# EAGLE design M703E (EAGLE 6.6.0)
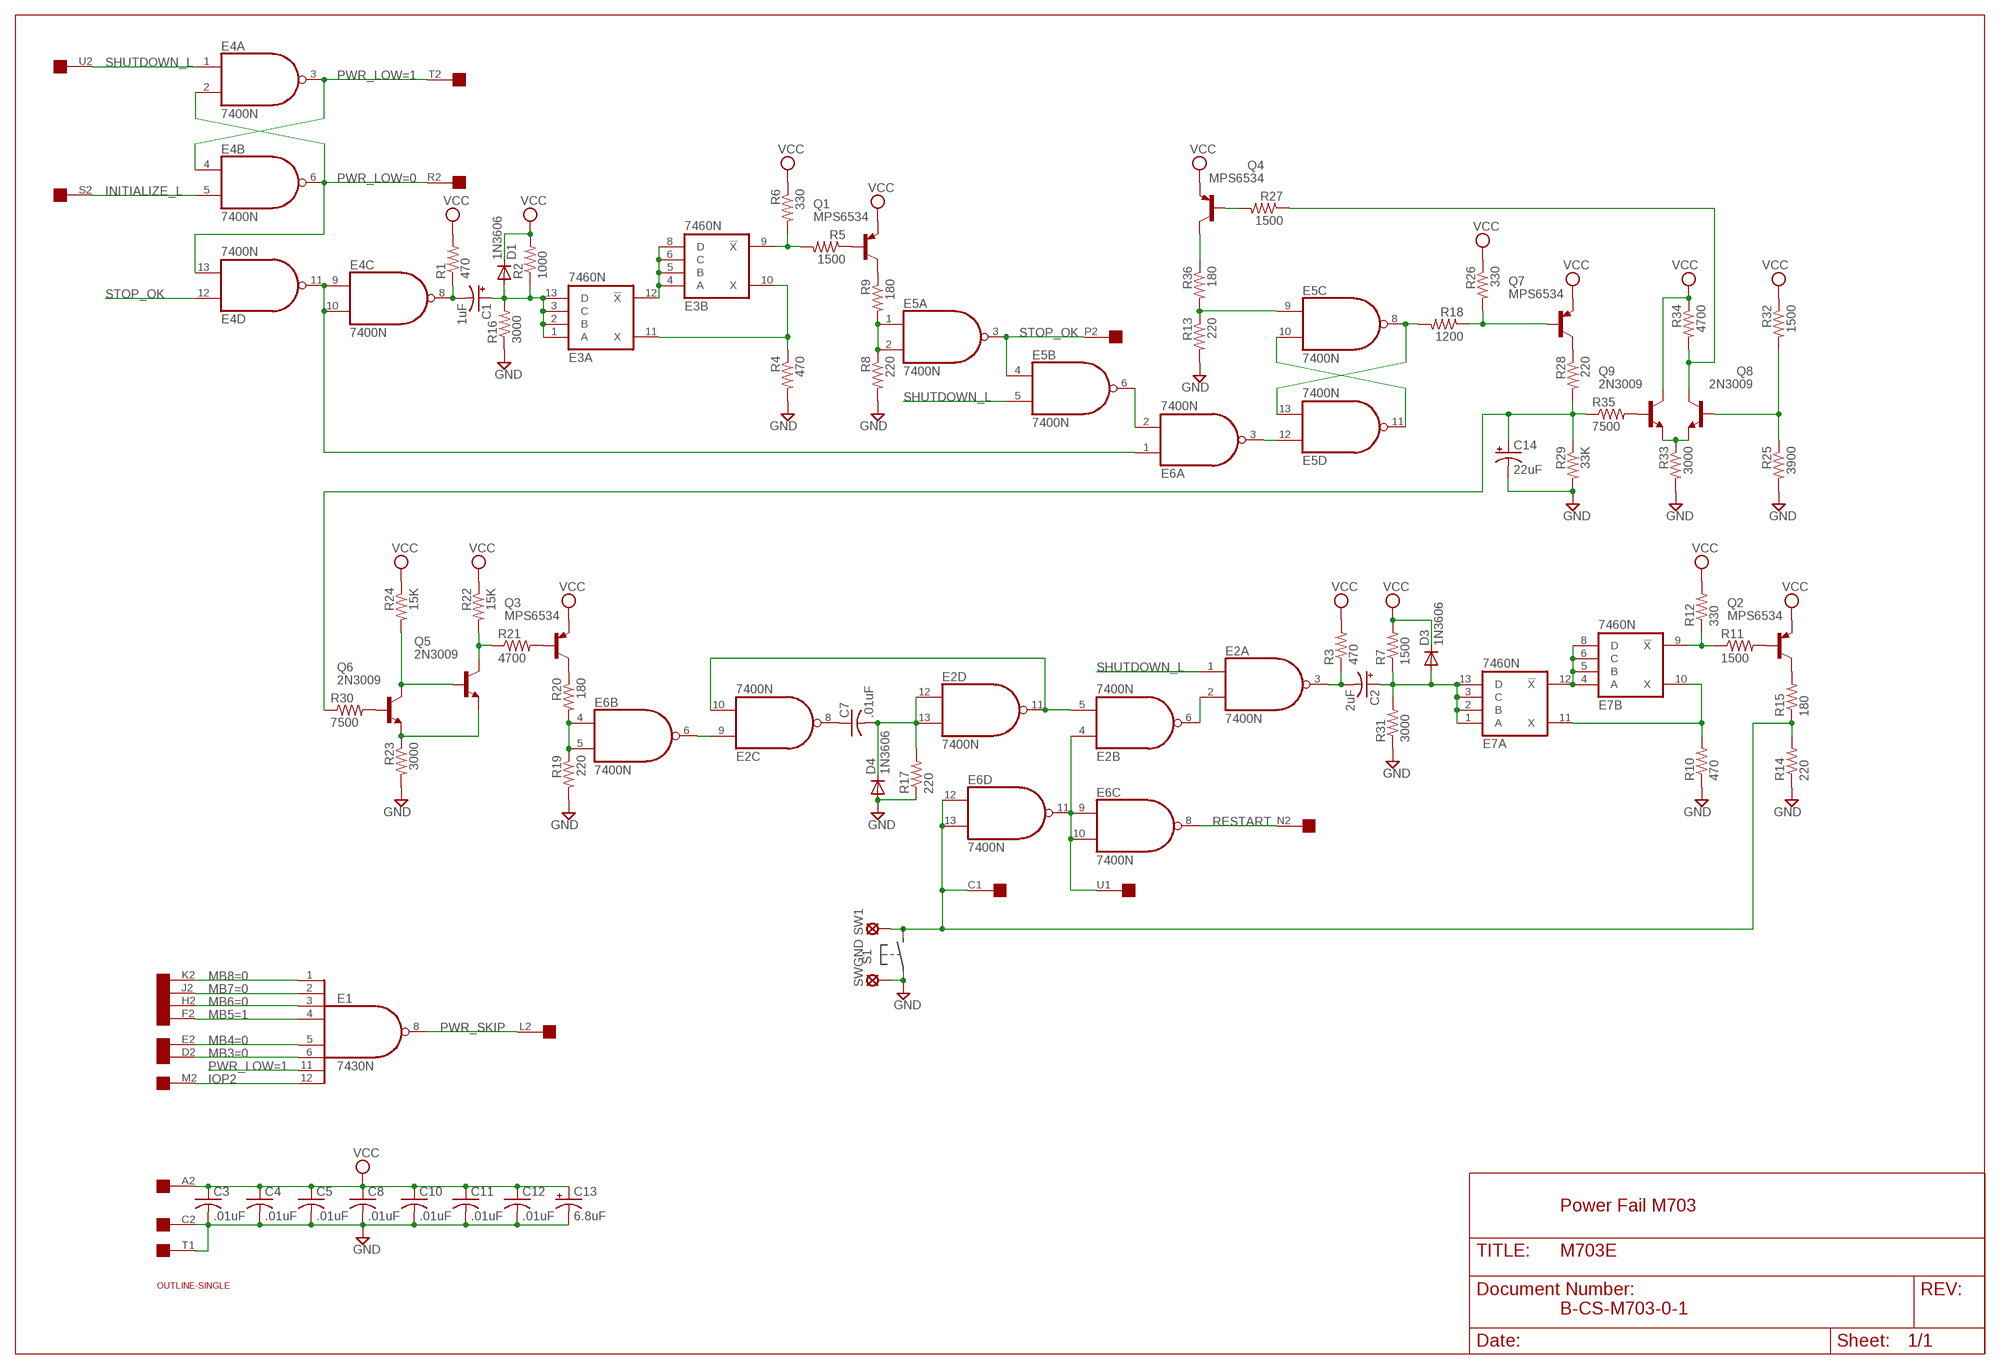
[diagram p0: schematic, sheet 1]

## Parts
C1  1uF  CPOL-USE12-4AXIAL  [E12-4]
C2  2uF  CPOL-USE12-4AXIAL  [E12-4]
C3  .01uF  C-US050-025X075  [C050-025X075]
C4  .01uF  C-US050-025X075  [C050-025X075]
C5  .01uF  C-US050-025X075  [C050-025X075]
C7  .01uF  C-US050-025X075  [C050-025X075]
C8  .01uF  C-US050-025X075  [C050-025X075]
C10  .01uF  C-US050-025X075  [C050-025X075]
C11  .01uF  C-US050-025X075  [C050-025X075]
C12  .01uF  C-US050-025X075  [C050-025X075]
C13  6.8uF  CPOL-USE15-5AXIAL  [E15-5]
C14  22uF  CPOL-USE15-5AXIAL  [E15-5]
D1  1N3606  1N4148DO35-10  [DO35-10]
D3  1N3606  1N4148DO35-10  [DO35-10]
D4  1N3606  1N4148DO35-10  [DO35-10]
E1  7430N  [DIL14]
E2  7400N  [DIL14]
E3  7460N  [DIL14]
E4  7400N  [DIL14]
E5  7400N  [DIL14]
E6  7400N  [DIL14]
E7  7460N  [DIL14]
Q1  MPS6534  2N2904  [TO39]
Q2  MPS6534  2N2904  [TO39]
Q3  MPS6534  2N2904  [TO39]
Q4  MPS6534  2N2904  [TO39]
Q5  2N3009  2N2219  [TO5]
Q6  2N3009  2N2219  [TO5]
Q7  MPS6534  2N2904  [TO39]
Q8  2N3009  2N2219  [TO5]
Q9  2N3009  2N2219  [TO5]
R1  470  R-US_0207/10  [0207/10]
R2  1000  R-US_0207/10  [0207/10]
R3  470  R-US_0207/10  [0207/10]
R4  470  R-US_0207/10  [0207/10]
R5  1500  R-US_0207/10  [0207/10]
R6  330  R-US_0207/10  [0207/10]
R7  1500  R-US_0207/10  [0207/10]
R8  220  R-US_0207/10  [0207/10]
R9  180  R-US_0207/10  [0207/10]
R10  470  R-US_0207/10  [0207/10]
R11  1500  R-US_0207/10  [0207/10]
R12  330  R-US_0207/10  [0207/10]
R13  220  R-US_0207/10  [0207/10]
R14  220  R-US_0207/10  [0207/10]
R15  180  R-US_0207/10  [0207/10]
R16  3000  R-US_0207/10  [0207/10]
R17  220  R-US_0207/10  [0207/10]
R18  1200  R-US_0207/10  [0207/10]
R19  220  R-US_0207/10  [0207/10]
R20  180  R-US_0207/10  [0207/10]
R21  4700  R-US_0207/10  [0207/10]
R22  15K  R-US_0207/10  [0207/10]
R23  3000  R-US_0207/10  [0207/10]
R24  15K  R-US_0207/10  [0207/10]
R25  3900  R-US_0207/10  [0207/10]
R26  330  R-US_0207/10  [0207/10]
R27  1500  R-US_0207/10  [0207/10]
R28  220  R-US_0207/10  [0207/10]
R29  33K  R-US_0207/10  [0207/10]
R30  7500  R-US_0207/10  [0207/10]
R31  3000  R-US_0207/10  [0207/10]
R32  1500  R-US_0207/10  [0207/10]
R33  3000  R-US_0207/10  [0207/10]
R34  4700  R-US_0207/10  [0207/10]
R35  7500  R-US_0207/10  [0207/10]
R36  180  R-US_0207/10  [0207/10]
SW1  SE14  [SE14]
SWGND  SE14  [SE14]
U$2  SINGLE  [EDGE-CON2]
U$4  OUTLINE-SINGLE  [SINGLE]

## Nets
GND [Supply]: C3.2 C4.2 C5.2 C8.2 C10.2 C11.2 C12.2 C13.- C14.- D4.A R4.2 R8.2 R10.1 R13.2 R14.1 R16.1 R17.1 R19.2 R23.2 R25.2 R29.2 R31.1 R33.2 SWGND.MP U$2.C2 U$2.T1
INITIALIZE_L: E4.5(B:I1) U$2.S2
IOP2: E1.12(I7) U$2.M2
MB3=0: E1.6(I5) U$2.D2
MB4=0: E1.5(I4) U$2.E2
MB5=1: E1.4(I3) U$2.F2
MB6=0: E1.3(I2) U$2.H2
MB7=0: E1.2(I1) U$2.J2
MB8=0: E1.1(I0) U$2.K2
N$1: E4.9(C:I0) E4.10(C:I1) E4.11(D:O) E6.1(A:I0)
N$2: E2.4(B:I0) E6.9(C:I0) E6.10(C:I1) E6.11(D:O) U$2.U1
N$3: C1.- E4.8(C:O) R1.1
N$4: E6.4(B:I0) E6.5(B:I1) R19.1 R20.2
N$5: E3.4(B:A) E3.5(B:B) E3.6(B:C) E3.8(B:D) E3.12(A:!X)
N$6: C1.+ D1.A E3.1(A:A) E3.2(A:B) E3.3(A:C) E3.13(A:D) R2.1 R16.2
N$7: C2.+ D3.A E7.1(A:A) E7.2(A:B) E7.3(A:C) E7.13(A:D) R7.1 R31.2
N$8: E7.4(B:A) E7.5(B:B) E7.6(B:C) E7.8(B:D) E7.12(A:!X)
N$9: E5.1(A:I0) E5.2(A:I1) R8.1 R9.2
N$10: C7.2 D4.C E2.12(D:I0) E2.13(D:I1) R17.2
N$11: E2.5(B:I1) E2.10(C:I1) E2.11(D:O)
N$12: C7.1 E2.8(C:O)
N$14: E2.2(A:I1) E2.6(B:O)
N$15: E5.8(C:O) E5.13(D:I1) R18.2
N$16: C2.- E2.3(A:O) R3.1
N$17: E6.12(D:I0) E6.13(D:I1) R14.2 R15.1 SW1.MP U$2.C1
N$18: E2.9(C:I0) E6.6(B:O)
N$19: E5.12(D:I0) E6.3(A:O)
N$20: E5.6(B:O) E6.2(A:I1)
N$21: Q1.2(B) R5.1
N$22: Q1.3(C) R9.1
N$23: E7.9(B:!X) R11.1 R12.1
N$24: E7.10(B:X) E7.11(A:X) R10.2
N$25: Q2.2(B) R11.2
N$26: E3.10(B:X) E3.11(A:X) R4.1
N$27: Q4.3(C) R36.1
N$28: E3.9(B:!X) R5.2 R6.2
N$29: E5.10(C:I1) E5.11(D:O)
N$30: E5.9(C:I0) R13.1 R36.2
N$31: Q7.2(B) R18.1 R26.2
N$32: Q8.1(E) Q9.1(E) R33.1
N$33: Q8.3(C) R27.1 R34.2
N$34: Q4.2(B) R27.2
N$35: Q8.2(B) R25.1 R32.2
N$36: Q9.2(B) R35.2
N$37: Q7.3(C) R28.1
N$38: C14.+ R28.2 R29.1 R30.1 R35.1
N$39: Q6.2(B) R30.2
N$40: Q5.2(B) Q6.3(C) R24.2
N$41: Q5.1(E) Q6.1(E) R23.1
N$42: Q5.3(C) R21.1 R22.2
N$43: Q3.2(B) R21.2
N$44: Q3.3(C) R20.1
N$46: Q2.3(C) R15.2
PWR_LOW=0: E4.2(A:I1) E4.6(B:O) E4.13(D:I1) U$2.R2
PWR_LOW=1: E1.11(I6) E4.3(A:O) E4.4(B:I0) U$2.T2
PWR_SKIP: E1.8(O) U$2.L2
RESTART: E6.8(C:O) U$2.N2
SHUTDOWN_L: E2.1(A:I0) E4.1(A:I0) E5.5(B:I1) U$2.U2
STOP_OK: E4.12(D:I0) E5.3(A:O) E5.4(B:I0) U$2.P2
VCC [Supply]: C3.1 C4.1 C5.1 C8.1 C10.1 C11.1 C12.1 C13.+ D1.C D3.C Q1.1(E) Q2.1(E) Q3.1(E) Q4.1(E) Q7.1(E) Q9.3(C) R1.2 R2.2 R3.2 R6.1 R7.2 R12.2 R22.1 R24.1 R26.1 R32.1 R34.1 U$2.A2
Unconnected: U$2.A1 U$2.B1 U$2.B2 U$2.D1 U$2.E1 U$2.F1 U$2.H1 U$2.J1 U$2.K1 U$2.L1 U$2.M1 U$2.N1 U$2.P1 U$2.R1 U$2.S1 U$2.V1 U$2.V2

## Notes on the sheet
- Power Fail M703
- B-CS-M703-0-1

## Power pins joined to a net without a drawn wire
GND: E1.7(GND) E2.7(P:GND) E3.7(P:GND) E4.7(P:GND) E5.7(P:GND) E6.7(P:GND) E7.7(P:GND)
VCC: E1.14(VCC) E2.14(P:VCC) E3.14(P:VCC) E4.14(P:VCC) E5.14(P:VCC) E6.14(P:VCC) E7.14(P:VCC)

## Library data of the parts
C1 C2 = dec-con:CPOL-USE12-4AXIAL: 0.5" veresion of an electrolytic
C3-C5 C7 C8 C10-C12 = rcl:C-US: CAPACITOR, American symbol
C13 C14 = rcl:CPOL-US: POLARIZED CAPACITOR, American symbol
D1 D3 D4 = diode:1N4148: DIODE high speed (Philips)
E1 = 74xx-us:74*30: 8-input NAND gate
E2 E4-E6 = 74xx-us:74*00: Quad 2-input NAND gate
E3 E7 = 74xx-us:74*60: Dual 4-input EXPANDER
Q1-Q4 Q7 = transistor-pnp:2N2904*: PNP Transistror
Q5 Q6 Q8 Q9 = transistor-npn:2N2219: NPN Transistor
R1-R36 = rcl:R-US_: RESISTOR, American symbol
SW1 SWGND = solpad:SE14: SOLDER PAD E1553, drill 1,4mm, distributor Buerklin, 07F820
U$2 = dec-con:SINGLE: Single-Height DEC board
U$4 = dec-con:OUTLINE-*: Board outlines for DEC boards.

## Net classes
1 Supply: width 0.813 mm

## Board
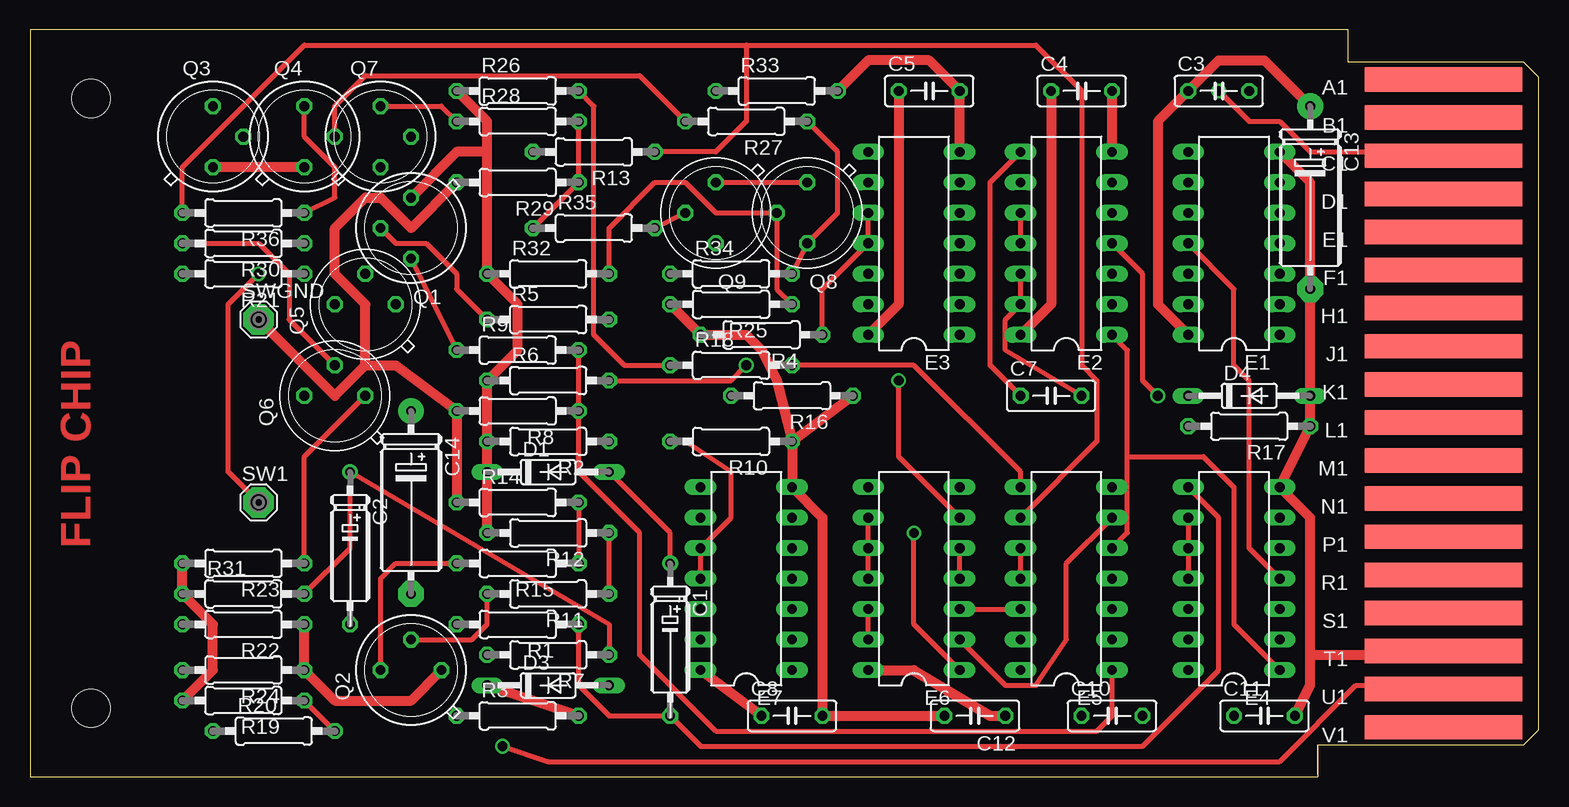
[diagram p1: board, top side]
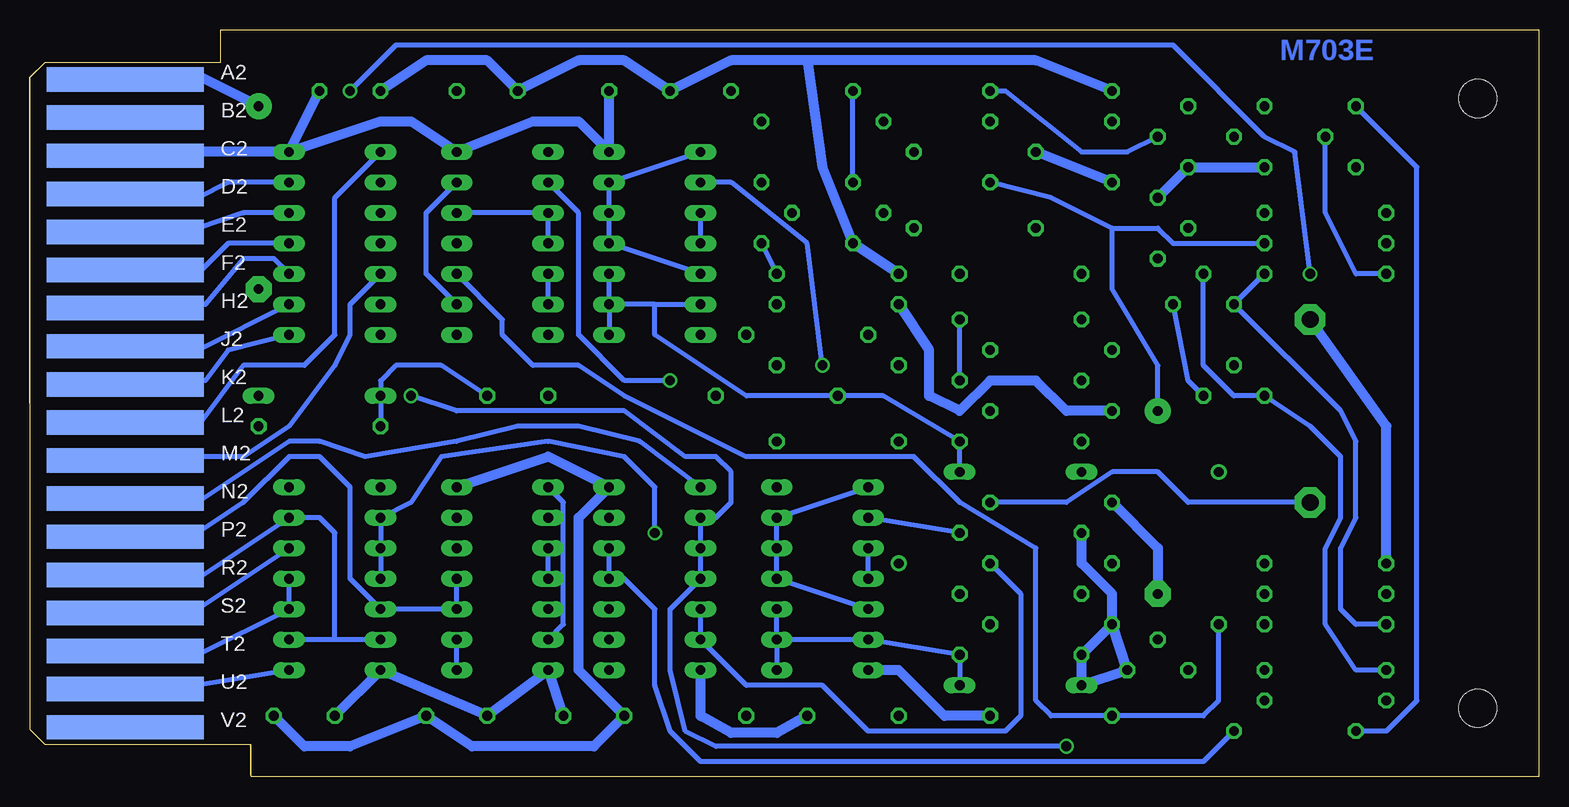
[diagram p2: board, bottom side, seen from below]

Size 125.73 x 62.23 mm. Coordinates in mm from the lower left corner, seen from the top.
Copper layers (1+16): Top 0.035mm / dielectric 1.5mm / Bottom 0.035mm
Design rules "16mils": minimum track width 16mil, minimum drill 32mil, track to track 15mil, track to pad 10mil, pad to pad 10mil, via to via 10mil, smd to smd 10mil, copper to edge 13mil, drill to drill 10mil, minimum pad ring 10mil, minimum via ring 8mil, stop-mask expansion 0mil, vias tented up to drill 0mil, thermal gap 10mil

### Footprints (pad centres in the part's own frame; a part is rotated, then mirrored left to right if it is on the bottom)
E12-4 = drill 0.813: + -7.62,0 | drill 0.813 octagon: - 5.08,0
C050-025X075 = drill 0.813 octagon: 1 -2.54,0; 2 2.54,0
E15-5 = drill 0.813 pad 2.159: + -7.62,0 | drill 0.813 pad 2.159 octagon: - 7.62,0
DO35-10 = drill 0.813 long: A 5.08,0; C -5.08,0
DIL14 = drill 0.813 long: 1 -7.62,-3.81; 2 -5.08,-3.81; 3 -2.54,-3.81; 4 0,-3.81; 5 2.54,-3.81; 6 5.08,-3.81; 7 7.62,-3.81; 8 7.62,3.81; 9 5.08,3.81; 10 2.54,3.81; 11 0,3.81; 12 -2.54,3.81; 13 -5.08,3.81; 14 -7.62,3.81
TO39 = drill 0.813 octagon: 1 0,-2.54; 2 2.54,0; 3 0,2.54
TO5 = drill 0.813 octagon: 1 0,-2.54; 2 2.54,0; 3 0,2.54
0207/10 = drill 0.813 octagon: 1 -5.08,0; 2 5.08,0
SE14 = drill 1.397 pad 2.54 octagon: MP 0,0
EDGE-CON2 = smd 13.106 x 2.032: A1 7.938,4.128; B1 7.938,7.303; C1 7.938,10.477; D1 7.938,13.652; E1 7.938,16.828; F1 7.938,20.003; H1 7.938,23.177; J1 7.938,26.352; K1 7.938,29.527; L1 7.938,32.703; M1 7.938,35.877; N1 7.938,39.053; P1 7.938,42.227; R1 7.938,45.403; S1 7.938,48.578; T1 7.938,51.752; U1 7.938,54.928; V1 7.938,58.102 | smd 13.106 x 2.032 bottom: A2 7.938,4.128; B2 7.938,7.303; C2 7.938,10.477; D2 7.938,13.652; E2 7.938,16.828; F2 7.938,20.003; H2 7.938,23.177; J2 7.938,26.352; K2 7.938,29.527; L2 7.938,32.703; M2 7.938,35.877; N2 7.938,39.053; P2 7.938,42.227; R2 7.938,45.403; S2 7.938,48.578; T2 7.938,51.752; U2 7.938,54.928; V2 7.938,58.102
SINGLE = hole 3.175: 120.65,56.515; 120.65,5.715

### Placement (x,y rotation side)
C1  53.34,10.16 270 top
C2  26.67,17.78 270 top
C3  99.06,57.15 0 top
C4  87.63,57.15 0 top
C5  74.93,57.15 0 top
C7  85.09,31.75 0 top
C8  63.5,5.08 0 top
C10  90.17,5.08 0 top
C11  102.87,5.08 0 top
C12  78.74,5.08 180 top
C13  106.68,48.26 270 top
C14  31.75,22.86 270 top
D1  43.18,25.4 0 top
D3  43.18,7.62 0 top
D4  101.6,31.75 0 top
E1  100.33,44.45 90 top
E2  86.36,44.45 90 top
E3  73.66,44.45 90 top
E4  100.33,16.51 90 top
E5  86.36,16.51 90 top
E6  73.66,16.51 90 top
E7  59.69,16.51 90 top
Q1  31.75,45.72 180 top
Q2  31.75,8.89 90 top
Q3  15.24,53.34 0 top
Q4  22.86,53.34 0 top
Q5  27.94,39.37 90 top
Q6  25.4,31.75 90 top
Q7  29.21,53.34 0 top
Q8  64.77,46.99 180 top
Q9  57.15,46.99 180 top
R1  40.64,12.7 180 top
R2  43.18,27.94 180 top
R3  40.64,5.08 0 top
R4  60.96,36.83 180 top
R5  43.18,38.1 0 top
R6  43.18,33.02 0 top
R7  43.18,10.16 180 top
R8  40.64,30.48 180 top
R9  40.64,35.56 0 top
R10  58.42,27.94 180 top
R11  43.18,15.24 180 top
R12  43.18,20.32 180 top
R13  46.99,52.07 180 top
R14  40.64,22.86 0 top
R15  40.64,17.78 180 top
R16  63.5,31.75 180 top
R17  101.6,29.21 180 top
R18  58.42,34.29 0 top
R19  17.78,6.35 180 top
R20  20.32,3.81 0 top
R21  17.78,41.91 180 top
R22  17.78,12.7 180 top
R23  17.78,17.78 180 top
R24  17.78,8.89 180 top
R25  58.42,39.37 180 top
R26  40.64,57.15 0 top
R27  59.69,54.61 180 top
R28  40.64,54.61 0 top
R29  40.64,49.53 180 top
R30  17.78,44.45 180 top
R31  17.78,15.24 0 top
R32  43.18,41.91 0 top
R33  62.23,57.15 0 top
R34  58.42,41.91 0 top
R35  46.99,45.72 0 top
R36  17.78,46.99 180 top
SW1  19.05,22.86 0 top
SWGND  19.05,38.1 0 top
U$1  [FLIPCHIP]  0,0 0 top
U$2  125.73,62.23 180 top
U$4  125.73,62.23 180 top

### Tracks (layer width: path | path; a pad name or v marks a point on that pad's centre or on a via)
GND
  Top 0.813: E3.7 C5.2 74.93,59.69 69.85,59.69 R33.2 | 106.68,10.16 106.68,7.62 C11.2 | 106.68,10.16 106.68,21.59 E4.7 R17.1 D4.A C13.- 106.68,49.53 E1.7 | U$2.T1 116.84,10.16 106.68,10.16 | E2.7 C4.2 | C12.2 C8.2 66.04,21.59 E7.7 R10.1 | R10.1 R16.1 | R25.2 R4.2 59.69,36.83 60.96,35.56 62.23,33.02 R10.1 | R14.1 R8.2 30.48,34.29 27.94,34.29 | R19.2 15.24,8.89 15.24,12.7 R31.1 R23.2 | R29.2 31.75,45.72 29.21,48.26 27.94,48.26 25.4,45.72 25.4,41.91 27.94,39.37 27.94,34.29 | 27.94,34.29 25.4,31.75 SWGND.MP
  Bottom 0.813: U$2.C2 116.84,52.07 E1.7 | E1.7 96.52,54.61 93.98,54.61 E2.7 83.82,54.61 80.01,54.61 E3.7 C5.2 | E1.7 C3.2 | C11.2 102.87,2.54 99.06,2.54 C10.2 88.9,2.54 78.74,2.54 C12.2 80.01,8.89 80.01,21.59 E6.7 82.55,26.67 E5.7 | R14.1 31.75,19.05 C14.- | R25.2 50.8,35.56 50.8,31.75 48.26,30.48 45.72,33.02 41.91,33.02 39.37,30.48 R8.2 | R23.2 12.7,29.21 SWGND.MP | R29.2 R13.2
INITIALIZE_L
  Bottom 0.406: U$2.S2 116.84,13.97 111.76,13.97 E4.5
IOP2
  Bottom 0.406: U$2.M2 116.84,26.67 107.95,26.67 104.14,29.21 100.33,34.29 99.06,36.83 99.06,39.37 E1.12
MB3=0
  Bottom 0.406: U$2.D2 116.84,48.26 111.76,48.26 109.22,49.53 E1.6
MB4=0
  Bottom 0.406: U$2.E2 116.84,45.72 111.76,45.72 107.95,46.99 E1.5
MB5=1
  Bottom 0.406: U$2.F2 116.84,41.91 111.76,41.91 109.22,44.45 E1.4
MB6=0
  Bottom 0.406: E1.3 105.41,43.18 107.95,43.18 111.12,39.37 116.84,39.37 U$2.H2
MB7=0
  Bottom 0.406: U$2.J2 116.84,35.56 111.76,35.56 E1.2
MB8=0
  Bottom 0.406: U$2.K2 116.84,33.02 111.12,33.02 109.22,35.56 E1.1
N$1  (via drill 0.81)
  Top 0.406: E4.9 E4.10 E4.11 | E6.1 73.66,12.7 v73.66,20.32
  Bottom 0.406: E4.11 E4.10 E4.9 93.98,22.86 91.44,26.67 82.55,27.94 76.2,26.67 73.66,24.13 v73.66,20.32
N$2  (via drill 0.81)
  Top 0.406: E6.9 E6.10 E6.11 | U$2.U1 116.84,7.62 110.49,7.62 104.14,1.27 43.18,1.27 v39.37,2.54 | v93.98,31.75 92.71,33.02 92.71,41.91 E2.4
  Bottom 0.406: v39.37,2.54 68.58,2.54 71.12,3.81 72.39,8.89 72.39,13.97 E6.11 E6.10 E6.9 68.58,21.59 67.31,22.86 67.31,25.4 68.58,26.67 71.12,26.67 76.2,30.48 90.17,30.48 v93.98,31.75
N$3
  Top 0.406: E4.8 99.06,21.59 99.06,8.89 92.71,2.54 55.88,2.54 C1.- 48.26,5.08 45.72,7.62 R1.1
N$4
  Top 0.406: E6.4 E6.5 | R19.1 R20.2
  Bottom 0.406: E6.5 E6.4 76.2,16.51 73.66,13.97 73.66,7.62 72.39,3.81 69.85,1.27 27.94,1.27 R20.2
N$5
  Bottom 0.406: E3.8 E3.6 E3.5 E3.4 E3.12
N$6
  Top 0.406: D1.A 53.34,20.32 C1.+
  Bottom 0.406: 73.66,39.37 E3.13 | 73.66,39.37 E3.2 | E3.2 E3.3 | E3.2 E3.1 | 73.66,39.37 73.66,36.83 66.04,31.75 R16.2 54.61,31.75 R2.1 D1.A
N$7
  Top 0.406: R7.1 48.26,12.7 C2.+ 26.67,19.05 R31.2
  Bottom 0.406: E7.2 E7.13 R7.1 D3.A | E7.2 E7.3 | E7.2 E7.1
N$8
  Bottom 0.406: E7.8 E7.6 E7.5 E7.4 E7.12
N$9
  Top 0.406: E5.1 90.17,5.08 88.9,3.81 57.15,3.81 50.8,10.16 50.8,20.32 45.72,25.4 R8.1 R9.2
  Bottom 0.406: E5.1 E5.2
N$10
  Top 0.406: E2.12 E2.13 81.28,38.1 81.28,35.56 C7.2
  Bottom 0.406: R17.2 D4.C 96.52,33.02 95.25,34.29 91.44,34.29 C7.2 | E2.13 E2.12
N$11
  Top 0.406: E2.11 E2.10
  Bottom 0.406: E2.11 E2.10 E2.5
N$12
  Top 0.406: E2.8 80.01,49.53 80.01,34.29 C7.1
N$14
  Bottom 0.406: E2.2 92.71,41.91 92.71,46.99 E2.6
N$15
  Top 0.406: R18.2 73.66,34.29 82.55,25.4 E5.8
  Bottom 0.406: E5.8 81.28,22.86 81.28,12.7 E5.13
N$16
  Bottom 0.406: E2.3 86.36,38.1 86.36,36.83 83.82,34.29 80.01,34.29 76.2,31.75 66.04,26.67 52.07,26.67 48.26,22.86 41.91,19.05 41.91,6.35 40.64,5.08 R3.1 27.94,5.08 26.67,6.35 C2.-
N$17  (via drill 0.81)
  Top 0.406: E6.13 E6.12 | U$2.C1 116.84,52.07 106.68,52.07 104.14,54.61 101.6,54.61 v99.06,57.15 | v19.05,41.91 16.51,39.37 16.51,25.4 SW1.MP | R14.2 R15.1
  Bottom 0.406: E6.12 E6.13 66.04,7.62 59.69,7.62 55.88,3.81 44.45,3.81 43.18,5.08 43.18,15.24 R15.1 | v99.06,57.15 95.25,60.96 30.48,60.96 22.86,53.34 20.32,52.07 v19.05,41.91 | SW1.MP 29.21,22.86 31.75,25.4 35.56,25.4 39.37,22.86 R14.2
N$18  (via drill 0.81)
  Top 0.406: E6.6 72.39,26.67 v72.39,33.02
  Bottom 0.406: E2.9 80.01,46.99 80.01,36.83 76.2,33.02 v72.39,33.02
N$19
  Top 0.406: E6.3 E5.12
N$20
  Top 0.406: E6.2 81.28,7.62 83.82,7.62 86.36,11.43 86.36,17.78 E5.6
N$21
  Top 0.406: Q1.2 30.48,44.45 33.02,44.45 35.56,41.91 35.56,40.64 R5.1
N$22
  Top 0.406: R9.1 Q1.3
N$23
  Top 0.406: R11.1 R12.1
  Bottom 0.406: R12.1 E7.9
N$24
  Top 0.406: E7.11 E7.10 58.42,21.59 58.42,25.4 54.61,27.94 R10.2
  Bottom 0.406: E7.11 E7.10
N$25
  Top 0.406: Q2.2 36.83,11.43 38.1,12.7 R11.2
N$26
  Top 0.406: E3.10 E3.11 66.04,40.64 R4.1
  Bottom 0.406: E3.11 E3.10
N$27
  Top 0.406: Q4.3 22.86,53.34 25.4,50.8 25.4,48.26 R36.1
N$28  (via drill 0.81)
  Top 0.406: R6.2 58.42,33.02 v59.69,34.29
  Bottom 0.406: E3.9 67.31,49.53 60.96,44.45 v59.69,34.29 | R6.2 R5.2
N$29
  Top 0.406: E5.11 E5.10
  Bottom 0.406: E5.11 E5.10
N$30
  Top 0.406: E5.9 88.9,27.94 88.9,33.02 87.63,34.29 87.63,57.15 83.82,60.96 59.69,60.96 | R13.1 57.15,52.07 59.69,54.61 59.69,60.96 | 59.69,60.96 22.86,60.96 12.7,50.8 R36.2
N$31
  Top 0.406: R26.2 46.99,55.88 46.99,36.83 49.53,34.29 R18.1
  Bottom 0.406: R26.2 44.45,57.15 38.1,52.07 34.29,52.07 Q7.2
N$32
  Top 0.406: Q9.1 Q8.1
  Bottom 0.406: Q9.1 R33.1
N$33
  Top 0.406: R34.2 Q8.3 67.31,46.99 67.31,52.07 R27.1
  Bottom 0.406: R34.2 Q8.3
N$34
  Top 0.406: Q4.2 25.4,55.88 27.94,58.42 50.8,58.42 R27.2
N$35
  Top 0.406: R25.1 62.23,40.64 Q8.2 57.15,46.99 54.61,49.53 52.07,49.53 48.26,45.72 R32.2
N$36
  Top 0.406: R35.2 Q9.2
N$37
  Top 0.406: Q7.3 34.29,55.88 R28.1
N$38
  Top 0.406: R28.2 R29.1 R35.1
  Bottom 0.406: R29.1 40.64,48.26 35.56,45.72 | 35.56,45.72 35.56,40.64 31.75,34.29 C14.+ | 35.56,45.72 31.75,45.72 30.48,44.45 R30.1
N$39
  Top 0.406: R30.2 19.05,44.45 21.59,41.91 21.59,38.1 Q6.2
N$40
  Bottom 0.406: Q5.2 27.94,34.29 25.4,31.75 Q6.3 19.05,29.21 16.51,26.67 16.51,21.59 17.78,19.05 17.78,12.7 15.24,8.89 R24.2
N$41
  Top 0.406: R23.1 22.86,26.67 Q6.1
  Bottom 0.406: Q6.1 29.21,33.02 Q5.1
N$42
  Bottom 0.406: R21.1 Q5.3 16.51,30.48 15.24,27.94 15.24,21.59 16.51,19.05 16.51,13.97 15.24,12.7 R22.2
N$43
  Bottom 0.406: Q3.2 17.78,46.99 15.24,41.91 R21.2
N$44
  Bottom 0.406: R20.1 12.7,3.81 10.16,6.35 10.16,50.8 Q3.3
N$46
  Top 0.406: R15.2 30.48,17.78 29.21,16.51 Q2.3
PWR_LOW=0
  Bottom 0.406: U$2.R2 116.84,16.51 111.76,16.51 E4.6 101.6,21.59 100.33,20.32 100.33,11.43 | 100.33,11.43 E4.2 | E4.13 100.33,11.43
PWR_LOW=1
  Top 0.406: E1.11 100.33,40.64 100.33,34.29 101.6,33.02 101.6,19.05 E4.4
  Bottom 0.406: U$2.T2 116.84,10.16 111.76,10.16 E4.3 E4.4
PWR_SKIP
  Bottom 0.406: U$2.L2 116.84,29.21 111.76,29.21 107.95,34.29 102.87,34.29 100.33,36.83 100.33,48.26 E1.8
RESTART
  Bottom 0.406: U$2.N2 116.84,22.86 111.76,22.86 104.14,27.94 101.6,27.94 97.79,26.67 90.17,27.94 85.09,29.21 80.01,29.21 74.93,27.94 E6.8
SHUTDOWN_L
  Top 0.406: E5.5 91.44,20.32 91.44,26.67 | 91.44,26.67 91.44,35.56 E2.1 | E4.1 100.33,12.7 100.33,24.13 97.79,26.67 91.44,26.67
  Bottom 0.406: U$2.U2 116.84,7.62 111.76,7.62 E4.1
STOP_OK
  Bottom 0.406: E5.4 E5.3 E4.12 99.06,16.51 99.06,24.13 101.6,26.67 104.14,26.67 107.95,22.86 111.76,20.32 116.84,20.32 U$2.P2
VCC
  Top 0.813: C13.+ 102.87,59.69 99.06,59.69 C3.1 93.98,54.61 93.98,39.37 E1.14 | E7.14 C8.1 | D3.C R3.2 | E3.14 72.39,39.37 C5.1 | E2.14 85.09,39.37 C4.1 | E6.14 73.66,8.89 80.01,5.08 C12.1 | R12.2 D1.C R2.2 R6.1 40.64,35.56 40.64,39.37 R32.1 38.1,52.07 | 38.1,52.07 38.1,54.61 R26.1 | Q1.1 35.56,52.07 38.1,52.07 | Q4.1 Q3.1 | R22.1 R24.1 25.4,6.35 31.75,6.35 Q2.1
  Bottom 0.813: U$2.A2 116.84,58.42 111.76,58.42 C13.+ | C3.1 92.71,59.69 87.63,59.69 C4.1 80.01,59.69 76.2,59.69 C5.1 67.31,59.69 60.96,59.69 | C11.1 E4.14 C10.1 E5.14 C12.1 | E6.14 69.85,5.08 67.31,3.65 63.5,3.65 C8.1 | R1.2 Q2.1 D3.C R7.2 R1.2 | E7.14 53.34,8.89 49.53,5.08 R3.2 | 60.96,59.69 59.69,50.8 Q9.3 R34.1 | 60.96,59.69 41.91,59.69 R26.1 | R1.2 35.56,15.24 38.1,17.78 R12.2 | Q1.1 Q7.1 Q4.1

### Text on the board
Bottom: M703E